# Altium schematic sheet Pwr.SchDoc
size A4
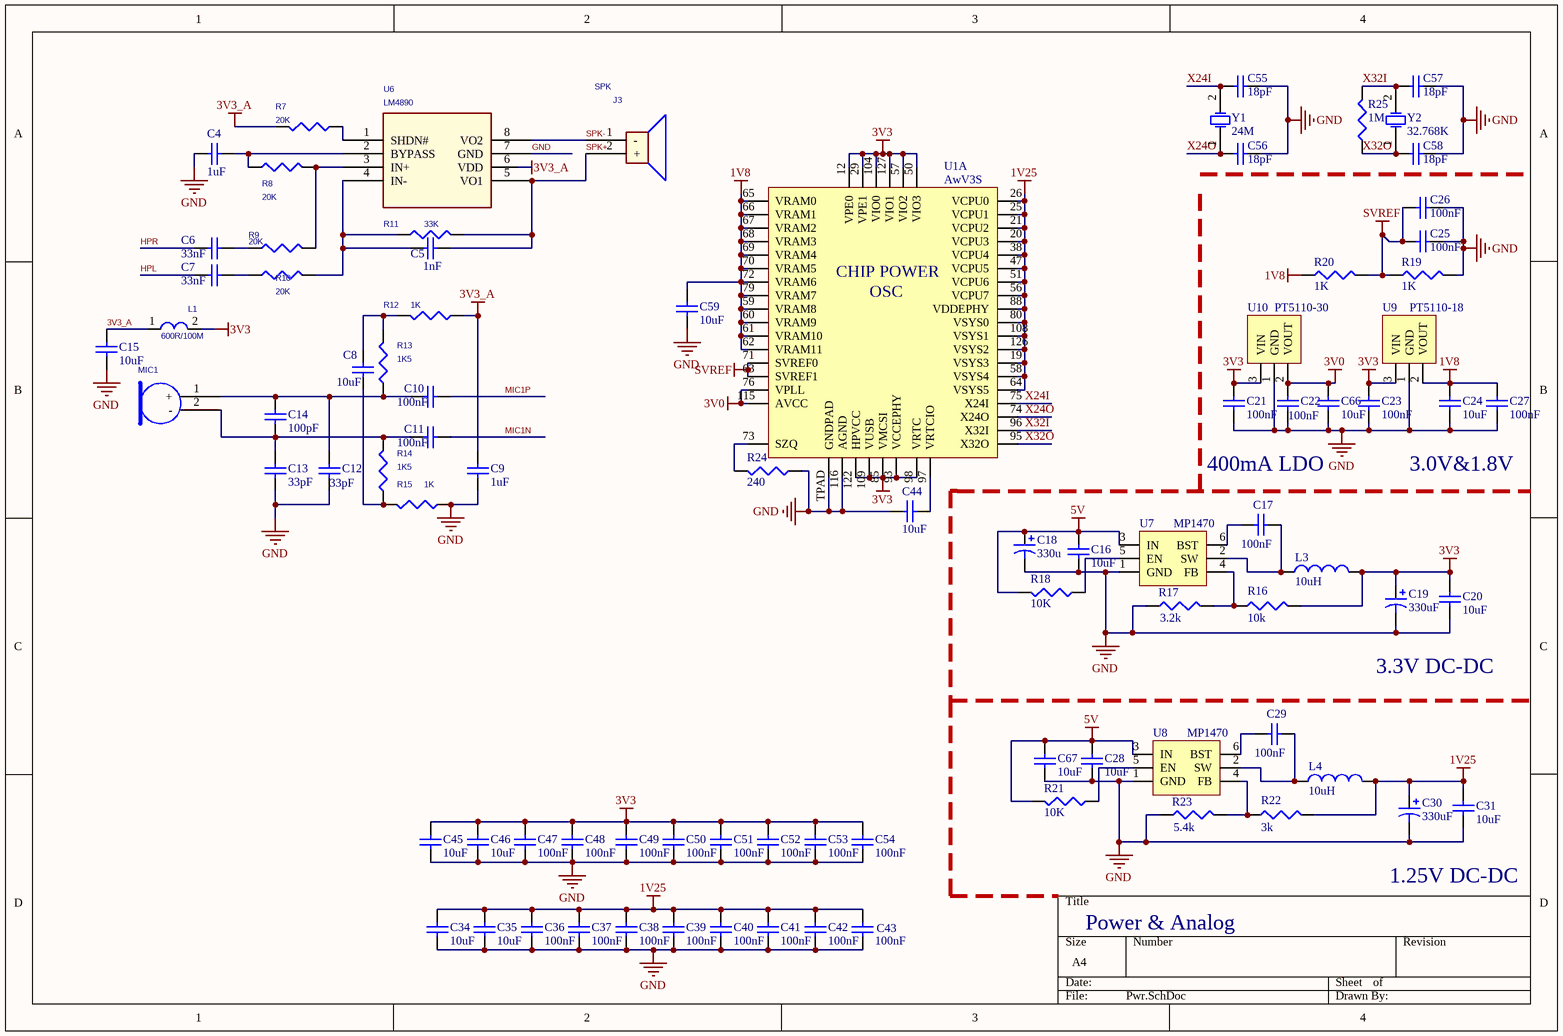
[diagram p0: Pwr.SchDoc]

## Parts
C4  value 1uF  [0603C]  (hidden comment: 105)
C5  value 1nF  [0603C]  (hidden comment: 102)
C6  value 33nF  [0603C]  (hidden comment: 333)
C7  value 33nF  [0603C]  (hidden comment: 333)
C8  value 10uF  [0603C]  (hidden comment: 105)
C9  value 1uF  [0603C]  (hidden comment: 105)
C10  value 100nF  [0603C]  (hidden comment: 104)
C11  value 100nF  [0603C]  (hidden comment: 104)
C12  value 33pF  [0603C]  (hidden comment: 333)
C13  value 33pF  [0603C]  (hidden comment: 333)
C14  value 100pF  [0603C]  (hidden comment: 101)
C15  value 10uF  [0603C]  (hidden comment: Cap)
C16  value 10uF  [0805-0C]  (hidden comment: 106)
C17  value 100nF  [0603C]  (hidden comment: 104)
C18  330u  [TanCap-1210]
C19  value 330uF  [TanCap-1210]  (hidden comment: 330u)
C20  value 10uF  [0805-0C]  (hidden comment: 106)
C21  value 100nF  [0603C]  (hidden comment: 104)
C22  value 100nF  [0603C]  (hidden comment: 104)
C23  value 100nF  [0603C]  (hidden comment: 104)
C24  value 10uF  [0603C]  (hidden comment: 104)
C25  value 100nF  [0603C]  (hidden comment: 104)
C26  value 100nF  [0603C]  (hidden comment: 104)
C27  value 100nF  [0603C]  (hidden comment: 106)
C28  value 10uF  [0805-0C]  (hidden comment: 106)
C29  value 100nF  [0603C]  (hidden comment: 104)
C30  value 330uF  [TanCap-1210]  (hidden comment: 330u)
C31  value 10uF  [0805-0C]  (hidden comment: 106)
C34  value 10uF  [0603C]  (hidden comment: 106)
C35  value 10uF  [0603C]  (hidden comment: 106)
C36  value 100nF  [0603C]  (hidden comment: Cap)
C37  value 100nF  [0603C]  (hidden comment: Cap)
C38  value 100nF  [0603C]  (hidden comment: Cap)
C39  value 100nF  [0603C]  (hidden comment: Cap)
C40  value 100nF  [0603C]  (hidden comment: Cap)
C41  value 100nF  [0603C]  (hidden comment: Cap)
C42  value 100nF  [0603C]  (hidden comment: Cap)
C43  value 100nF  [0603C]  (hidden comment: Cap)
C44  value 10uF  [0603C]  (hidden comment: 106)
C45  value 10uF  [0603C]  (hidden comment: 106)
C46  value 10uF  [0603C]  (hidden comment: 106)
C47  value 100nF  [0603C]  (hidden comment: Cap)
C48  value 100nF  [0603C]  (hidden comment: Cap)
C49  value 100nF  [0603C]  (hidden comment: Cap)
C50  value 100nF  [0603C]  (hidden comment: Cap)
C51  value 100nF  [0603C]  (hidden comment: Cap)
C52  value 100nF  [0603C]  (hidden comment: Cap)
C53  value 100nF  [0603C]  (hidden comment: Cap)
C54  value 100nF  [0603C]  (hidden comment: Cap)
C55  value 18pF  [0603C]  (hidden comment: 18P)
C56  value 18pF  [0603C]  (hidden comment: 18P)
C57  value 18pF  [0603C]  (hidden comment: 33P)
C58  value 18pF  [0603C]  (hidden comment: 33P)
C59  value 10uF  [0603C]  (hidden comment: 106)
C66  value 10uF  [0603C]  (hidden comment: 106)
C67  value 10uF  [0805-0C]  (hidden comment: 106)
J3  SPK  [HDR1X2]
L1  600R/100M  [L0603]
L3  10uH  [PIND0650]
L4  value 10uH  [PIND0650]  (hidden comment: Inductor)
MIC1  Micphone  [mic_4015]  (value not drawn)
R7  20K  [0603R]
R8  20K  [0603R]
R9  20K  [0603R]
R10  20K  [0603R]
R11  33K  [0603R]
R12  1K  [0603R]
R13  1K5  [0603R]
R14  1K5  [0603R]
R15  1K  [0603R]
R16  10K  [0603R]
R17  value 3.2k  [0603R]  (hidden comment: 3K2)
R18  10K  [0603R]
R19  1K  [0603R]
R20  1K  [0603R]
R21  10K  [0603R]
R22  3K  [0603R]
R23  5.4K  [0603R]
R24  240  [0603R]
R25  1M  [0603R]
U1  AwV3S  (part A of 4)
U6  LM4890  [MSOP8]
U7  MP1470  [SOT23-6]
U8  MP1470  [SOT23-6]
U9  PT5110-18  [SOT-23]
U10  PT5110-30  [SOT-23]
Y1  24M  [XTAL-5032]
Y2  32.768K  [XTAL-3215]

## Nets
1V8: C24.2 C27.2 C59.2 R20.1 U1.59(VRAM8) U1.60(VRAM9) U1.61(VRAM10) U1.62(VRAM11) U1.65(VRAM0) U1.66(VRAM1) U1.67(VRAM2) U1.68(VRAM3) U1.69(VRAM4) U1.70(VRAM5) U1.72(VRAM6) U1.79(VRAM7) U9.2(VOUT)
1V25: C30.1 C31.2 C34.2 C35.2 C36.2 C37.2 C38.2 C39.2 C40.2 C41.2 C42.2 C43.2 L4.2 R22.2 U1.19(VSYS3) U1.20(VCPU3) U1.21(VCPU2) U1.25(VCPU1) U1.26(VCPU0) U1.38(VCPU4) U1.47(VCPU5) U1.51(VCPU6) U1.56(VCPU7) U1.58(VSYS4) U1.64(VSYS5) U1.80(VSYS0) U1.88(VDDEPHY) U1.108(VSYS1) U1.126(VSYS2)
3V0: C22.2 C66.1 U1.76(VPLL) U1.115(AVCC) U10.2(VOUT)
3V3: C19.1 C20.2 C21.2 C23.2 C45.2 C46.2 C47.2 C48.2 C49.2 C50.2 C51.2 C52.2 C53.2 C54.2 L1.2 L3.2 R16.2 U1.12(VPE0) U1.29(VPE1) U1.50(VIO3) U1.57(VIO2) U1.85(VMCSI) U1.93(VCCEPHY) U1.98(VRTC) U1.104(VIO0) U1.109(VUSB) U1.122(HPVCC) U1.127(VIO1) U9.3(VIN) U10.3(VIN)
3V3_A: C9.2 C15.2 L1.1 R7.2 R12.1 U6.6(VDD)
5V: C16.2 C18.1 C28.2 C67.2 R18.2 R21.2 U7.3(IN) U8.3(IN)
GND: C4.2 C9.1 C12.1 C13.1 C15.1 C16.1 C18.2 C19.2 C20.1 C21.1 C22.1 C23.1 C24.1 C25.2 C26.2 C27.1 C28.1 C30.2 C31.1 C34.1 C35.1 C36.1 C37.1 C38.1 C39.1 C40.1 C41.1 C42.1 C43.1 C44.1 C45.1 C46.1 C47.1 C48.1 C49.1 C50.1 C51.1 C52.1 C53.1 C54.1 C55.2 C56.2 C57.2 C58.2 C59.1 C66.2 C67.1 R15.1 R17.1 R19.2 R23.1 R24.1 U1.116(AGND) U1.TPAD(GNDPAD) U6.7(GND) U7.1(GND) U8.1(GND) U9.1(GND) U10.1(GND)
SVREF: C25.1 C26.1 R19.1 R20.2 U1.63(SVREF1) U1.71(SVREF0)
HPL: C7.2
HPR: C6.2
MIC1N: C11.1
MIC1P: C10.1
SPK+: C5.1 J3.2(+) R11.2 U6.5(VO1)
SPK-: J3.1(-) U6.8(VO2)
X24I: C55.1 U1.75(X24I) Y1.2(OSC2)
X24O: C56.1 U1.74(X24O) Y1.1(OSC1)
X32I: C57.1 R25.2 U1.96(X32I) Y2.2(OSC2)
X32O: C58.1 R25.1 U1.95(X32O) Y2.1(OSC1)
NetC4_1: C4.1 R8.1 U6.2(BYPASS)
NetC5_2: C5.2 R10.2 R11.1 U6.4(IN-)
NetC6_1: C6.1 R9.1
NetC7_1: C7.1 R10.1
NetC8_1: C8.1 R14.1 R15.2
NetC8_2: C8.2 R12.2 R13.2
NetC10_2: C10.2 C12.2 C14.2 MIC1.1(+) R13.1
NetC11_2: C11.2 C13.2 C14.1 MIC1.2(-) R14.2
NetC17_1: C17.1 L3.1 U7.2(SW)
NetC17_2: C17.2 U7.6(BST)
NetC29_1: C29.1 L4.1 U8.2(SW)
NetC29_2: C29.2 U8.6(BST)
NetC44_2: C44.2 U1.97(VRTCIO)
NetR7_1: R7.1 U6.1(SHDN#)
NetR8_2: R8.2 R9.2 U6.3(IN+)
NetR16_1: R16.1 R17.2 U7.4(FB)
NetR18_1: R18.1 U7.5(EN)
NetR21_1: R21.1 U8.5(EN)
NetR22_1: R22.1 R23.2 U8.4(FB)
NetR24_2: R24.2 U1.73(SZQ)

## Notes on the sheet
- 400mA LDO
- 3.0V&1.8V
- 3.3V DC-DC
- 1.25V DC-DC
- Power & Analog
- (in symbol Aw_V3S, part A) CHIP POWER; OSC

## Library data of the parts
C4-C15 C25 C26 C34-C58 = Cap: Capacitor; Published: 8-Jun-2000; LatestRevisionDate: 17-Jul-2002; LatestRevisionNote: Re-released for DXP Platform.; PackageReference: RAD-0.3; Publisher: Altium Limited; PackageDescription: Radial Cap, Thru-Hole; 2 Leads; 0.3 in Pin Spacing
C16 C17 C20 C28 C29 C31 C67 = Cap: Ceramic Capacitor 0603; Published: 8-Jun-2000; LatestRevisionDate: 17-Jul-2002; LatestRevisionNote: Re-released for DXP Platform.; PackageReference: RAD-0.3; Publisher: Altium Limited; PackageDescription: Radial Cap, Thru-Hole; 2 Leads; 0.3 in Pin Spacing
C18 C19 C30 = Cap Pol1: Polarized Capacitor (Radial); Published: 8-Jun-2000; LatestRevisionDate: 17-Jul-2002; LatestRevisionNote: Re-released for DXP Platform.; PackageReference: RB7.6-15; Publisher: Altium Limited; PackageDescription: Polarized Capacitor (Radial); 2 Leads
  C18: Value: 330u
C21-C24 C27 C59 = Cap: Ceramic 0603 Capacitor; Published: 8-Jun-2000; LatestRevisionDate: 17-Jul-2002; LatestRevisionNote: Re-released for DXP Platform.; PackageReference: RAD-0.3; Publisher: Altium Limited; PackageDescription: Radial Cap, Thru-Hole; 2 Leads; 0.3 in Pin Spacing
C66 = Cap: 0603 Ceramic Capacitor; Published: 8-Jun-2000; LatestRevisionDate: 17-Jul-2002; LatestRevisionNote: Re-released for DXP Platform.; PackageReference: RAD-0.3; Publisher: Altium Limited; PackageDescription: Radial Cap, Thru-Hole; 2 Leads; 0.3 in Pin Spacing
J3 = SPEAKER
L1 = INDUCTOR_0_Dup1: RoHS BEAD/600ohm 100Mhz Z=600Ω DCR<0.2Ω 800mA SMT L0603; OriginalSymbolOrigin: (10,0); Pin Numbers Visible: TRUE; Pin Names Visible: FALSE; Package: SMT; Pin Names Rotate: TRUE
L3 L4 = Inductor: Inductor 0606; Code_IEC: 1005; Published: 8-Jun-2000; LatestRevisionDate: 29-May-2009; LatestRevisionNote: IPC-7351 Footprint Added.; PackageReference: 0402-A; Publisher: Altium Limited; PackageDescription: Chip Inductor; Code_JEITA: 0402
  L3: Value: 10uH
MIC1 = Micphone_0: mypage: 13
R7-R9 = ?_0: 规格型号: 原材料; 元件类别: 电阻20K,±5%,1/16W,0402 每盘10K; 元件编号: 电阻; Vendor: R0402; 备注: YCL0479
R10 = ?_0: 备注: YCL0479; Vendor: R0402; 元件编号: 电阻; 元件类别: 电阻20K,±5%,1/16W,0402 每盘10K; 规格型号: 原材料
R11 = ?_0: 规格型号: 原材料; 元件类别: 电阻33K,±5%,1/16W,0402 每盘10K; 元件编号: 电阻; Vendor: R0402; 备注: YCL0466
R12-R15 = R_Dup4: mypage: 13
R16-R18 R21-R25 = Res3: Resistor; Published: 8-Jun-2000; LatestRevisionDate: 29-May-2009; LatestRevisionNote: IPC-7351 Footprint Added.; PackageReference: J1-0603; Publisher: Altium Limited; PackageDescription: Chip Resistor
  R16: Value: 10k
  R18 R21: Value: 10K
  R22: Value: 3k
  R23: Value: 5.4k
  R24: Value: 240
  R25: Value: 1M
R19 R20 = Res3: 0603 Resistor; Published: 8-Jun-2000; LatestRevisionDate: 29-May-2009; LatestRevisionNote: IPC-7351 Footprint Added.; PackageReference: J1-0603; Publisher: Altium Limited; PackageDescription: Chip Resistor; Value: 1K
U1 = Aw_V3S
U6 = LY8006_0: 备注: YCL0064; 元件编号: IC; 元件类别: 功放IC4890 / TF690; 规格型号: 原材料; Vendor: MSOP8
U9 U10 = PT5110
Y1 Y2 = XTAL: Crystal Oscillator; Published: 8-Jun-2000; LatestRevisionDate: 17-Jul-2002; LatestRevisionNote: Re-released for DXP Platform.; PackageReference: R38; Publisher: Altium Limited; PackageDescription: Crystal, Thru-Hole; 2 Leads; Body 3.1 x 8.2 mm (Dia.xH)